# Altium project Accessory_Breakout_X1.PrjPcb
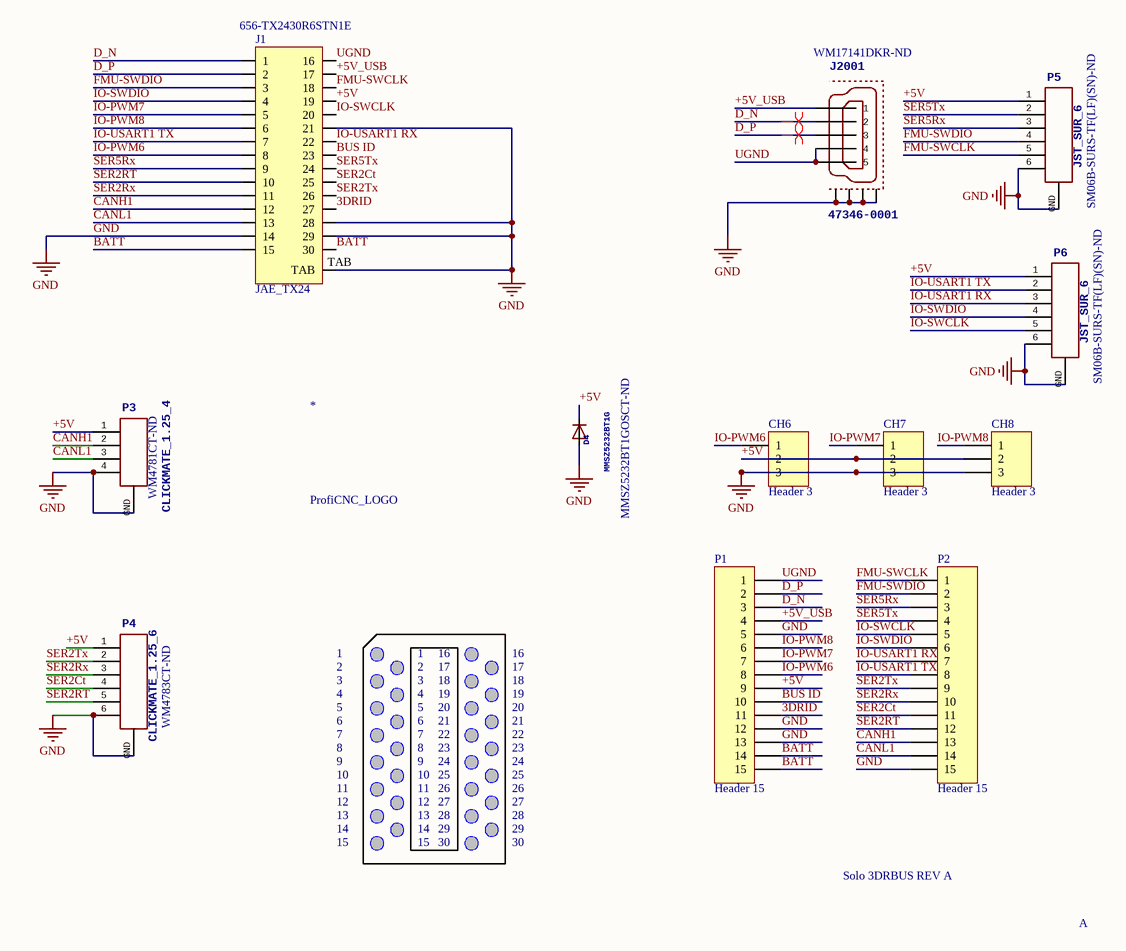
[diagram p0: Accessory_Breakout_X1.SchDoc]
1 sheet, 13 parts. Net scope: global (net labels, ports and power ports of the same name join across sheets).
Board file: Accessory_Breakout_X1.PcbDoc

## Sheet Accessory_Breakout_X1.SchDoc
size A3

### Parts
*  ProfiCNC_LOGO  [ProfiCNC_medium]  (no BOM)
CH6  Header 3  [HDR1X3]
CH7  Header 3  [HDR1X3]
CH8  Header 3  [HDR1X3]
D4  MMSZ5232BT1G  Supplier Part Number 1: MMSZ5232BT1GOSCT-ND  [SOD-123]
J1  JAE_TX24  Supplier Part Number 1: 656-TX2430R6STN1E  [JAE TX24]
J2001  47346-0001  Supplier Part Number 1: WM17141DKR-ND  [MOLEX-47346-0001]
P1  Header 15  [HDR1X15]
P2  Header 15  [HDR1X15]
P3  CLICKMATE_1.25_4  Supplier Part Number 1: WM4781CT-ND  [CLICKMATE_V4]
P4  CLICKMATE_1.25_6  Supplier Part Number 1: WM4783CT-ND  [CLICKMATE_V6]
P5  JST_SUR_6  Supplier Part Number 1: SM06B-SURS-TF(LF)(SN)-ND  [JST_SUR_H6]
P6  JST_SUR_6  Supplier Part Number 1: SM06B-SURS-TF(LF)(SN)-ND  [JST_SUR_H6]

### Nets
GND: CH6.3 CH7.3 CH8.3 D4.A J1.14 J1.21 J1.28 J1.29 J1.TAB J2001.GND1 J2001.GND2 J2001.GND3 J2001.GND4 P1.5 P1.12 P1.13 P2.15 P3.4 P3.GND P4.6 P4.GND P5.6 P5.GND P6.6 P6.GND
3DRID: J1.27 P1.11
+5V: CH6.2 CH7.2 CH8.2 D4.C J1.19 P1.9 P3.1 P4.1 P5.1 P6.1
+5V_USB: J1.17 J2001.VBUS(1) P1.4
BATT: J1.15 J1.30 P1.14 P1.15
BUS ID: J1.23 P1.10
CANH1: J1.12 P2.13 P3.2
CANL1: J1.13 P2.14 P3.3
D_N: J1.1 J2001.D-(2) P1.3
D_P: J1.2 J2001.D+(3) P1.2
FMU-SWCLK: J1.18 P2.1 P5.5
FMU-SWDIO: J1.3 P2.2 P5.4
IO-PWM6: CH6.1 J1.8 P1.8
IO-PWM7: CH7.1 J1.5 P1.7
IO-PWM8: CH8.1 J1.6 P1.6
IO-SWCLK: J1.20 P2.5 P6.5
IO-SWDIO: J1.4 P2.6 P6.4
IO-USART1 RX: J1.22 P2.7 P6.3
IO-USART1 TX: J1.7 P2.8 P6.2
SER2Ct: J1.25 P2.11 P4.4
SER2RT: J1.10 P2.12 P4.5
SER2Rx: J1.11 P2.10 P4.3
SER2Tx: J1.26 P2.9 P4.2
SER5Rx: J1.9 P2.3 P5.3
SER5Tx: J1.24 P2.4 P5.2
UGND: J1.16 J2001.GND(5) J2001.ID(4) P1.1

### Layout directives
differential pair: D_N, D_P

### Notes on the sheet
- 1
- 2
- 16
- 17
- 3
- 4
- 5
- 6
- 7
- 8
- 18
- 19
- 20
- 21
- 22
- 23
- 9
- 10
- 11
- 12
- 24
- 25
- 26
- 27
- 13
- 14
- 15
- 28
- 29
- 30
- Solo 3DRBUS REV A
- A
- http://www.oshwa.org/
- http://creativecommons.org/licenses/by-sa/3.0/
- Title:
- Date:
- Time:
- Sheet:
- Approved:
- of:
- Drawn By:
- Checked By:
- ProfiCNC

### Library data of the parts
CH6-CH8 = Header 3: Header, 3-Pin; LatestRevisionDate: 17-Jul-2002; LatestRevisionNote: Re-released for DXP Platform.; Publisher: Altium Limited
D4 = DIODESOD-123: DIODE ZENER 5.6V 500MW SOD123; 3DR_PARTNO: ECM0536; Supplier 1: Digi-Key; Value: 5.6V
J2001 = MOLEX-47346-0001: MICRO USB B, BOTTOM MOUNT; 3DR_PARTNO: ECM0486; PARTNO: 0473460001; Supplier 1: Digi-Key
P1 P2 = Header 15: Header, 15-Pin; LatestRevisionDate: 17-Jul-2002; LatestRevisionNote: Re-released for DXP Platform.; Publisher: Altium Limited
P3 = CLICKMATE_1.25_4: Connector, Rcpt, 4Pos, 1.25MM, W/B, VERT, SMD, Tin; 3DR_PARTNO: PRT0441; Supplier 1: Digi-Key
P4 = CLICKMATE_1.25_6: Connector, Rcpt, 6Pos, 1.25MM, W/B, VERT, SMD, Tin; 3DR_PARTNO: PRT0439; Supplier 1: Digi-Key
P5 P6 = JST_SUR_6: Connector, Header, 6Pos, .8mm IDC, R/A, SMD, Tin; 3DR_PARTNO: PRT0442; Supplier 1: Digi-Key
J1 = JAE_TX24: Supplier 1: Mouser

## Assembly variants
Accessory_Breakout_X1: not fitted 3DR Logo CH6 CH7 CH8 P1 P2